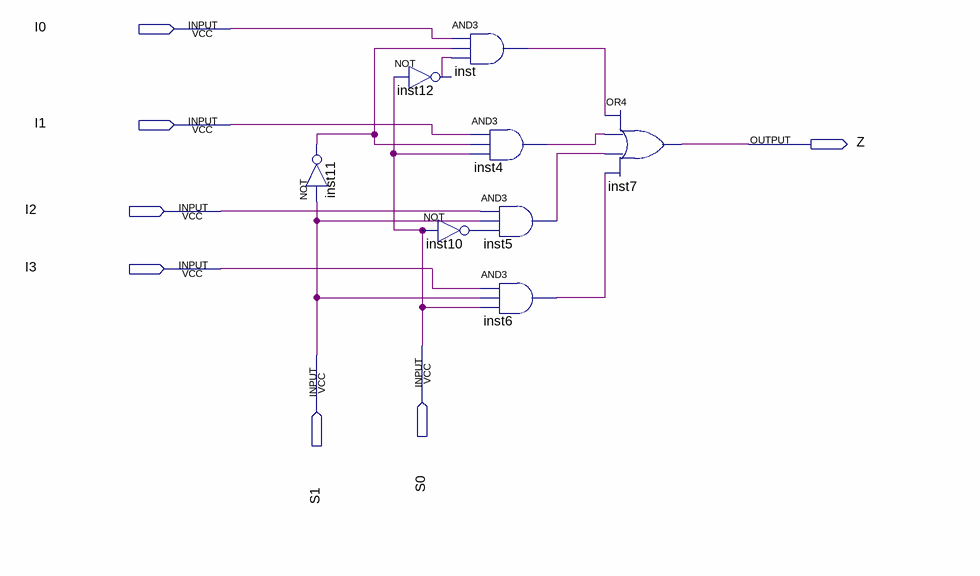
[diagram p0: schematic sheet]
// Quartus schematic s1111408_lab02_3.bdf as structural Verilog: 8 symbols, 7 pins
module s1111408_lab02_3 (
  input  I0,
  input  I1,
  input  I2,
  input  I3,
  input  S0,
  input  S1,
  output Z
);

  wire inst4_out, inst5_out, inst6_out, inst10_out, inst11_out, inst12_out, inst_out;

  not inst11 (inst11_out, S1);
  not inst12 (inst12_out, S0);
  not inst10 (inst10_out, S0);
  and inst (inst_out, I0, inst11_out, inst12_out);
  and inst4 (inst4_out, I1, inst11_out, S0);
  and inst5 (inst5_out, I2, S1, inst10_out);
  and inst6 (inst6_out, I3, S1, S0);
  or inst7 (Z, inst_out, inst4_out, inst5_out, inst6_out);
endmodule
